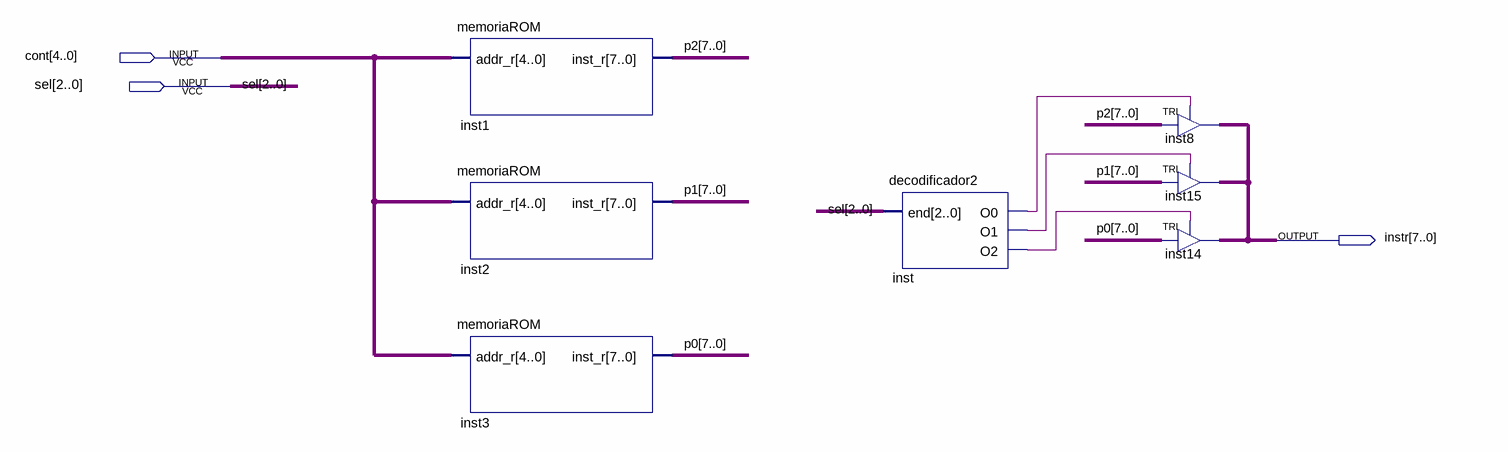
[diagram p0: schematic sheet]
// Quartus schematic bancoROM.bdf as structural Verilog: 7 symbols, 3 pins
module bancoROM (
  input  [4:0] cont,
  input  [2:0] sel,
  output [7:0] instr
);

  wire inst_o0, inst_o1, inst_o2;
  wire [7:0] p0, p1, p2;

  memoriaROM inst1 (.addr_r(cont), .inst_r(p2));
  memoriaROM inst2 (.addr_r(cont), .inst_r(p1));
  memoriaROM inst3 (.addr_r(cont), .inst_r(p0));
  decodificador2 inst (.\end (sel), .O0(inst_o0), .O1(inst_o1), .O2(inst_o2));
  TRI inst8[7:0] (.IN(p2), .OE(inst_o0), .OUT(instr));
  TRI inst15[7:0] (.IN(p1), .OE(inst_o1), .OUT(instr));
  TRI inst14[7:0] (.IN(p0), .OE(inst_o2), .OUT(instr));
endmodule
